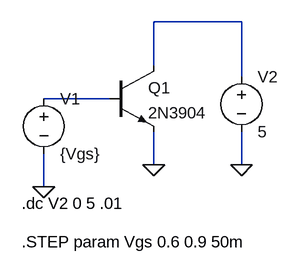
[diagram p0: schematic 2N3904.asc]
2N3904.asc, the LTspice schematic file:
Version 4
SHEET 1 880 680
WIRE 336 48 208 48
WIRE 208 112 208 48
WIRE 336 128 336 48
WIRE 144 160 48 160
WIRE 208 256 208 208
WIRE 336 256 336 208
WIRE 48 288 48 240
FLAG 208 256 0
FLAG 336 256 0
FLAG 48 288 0
SYMBOL voltage 48 144 R0
WINDOW 123 0 0 Left 0
WINDOW 39 0 0 Left 0
SYMATTR InstName V1
SYMATTR Value {Vgs}
SYMBOL voltage 336 112 R0
WINDOW 123 0 0 Left 0
WINDOW 39 0 0 Left 0
SYMATTR InstName V2
SYMATTR Value 5
SYMBOL npn3 144 112 R0
SYMATTR InstName Q1
SYMATTR Value 2N3904
TEXT 16 312 Left 2 !.dc V2 0 5 .01
TEXT 16 368 Left 2 !.STEP param Vgs 0.6 0.9 50m

The netlist it stands for:
* 2N3904.asc
V1 N002 0 {Vgs}
V2 N001 0 5
Q1 N001 N002 0 0 2N3904
.model NPN NPN
.model PNP PNP
.lib standard.bjt
.dc V2 0 5 .01
.STEP param Vgs 0.6 0.9 50m
.backanno
.end